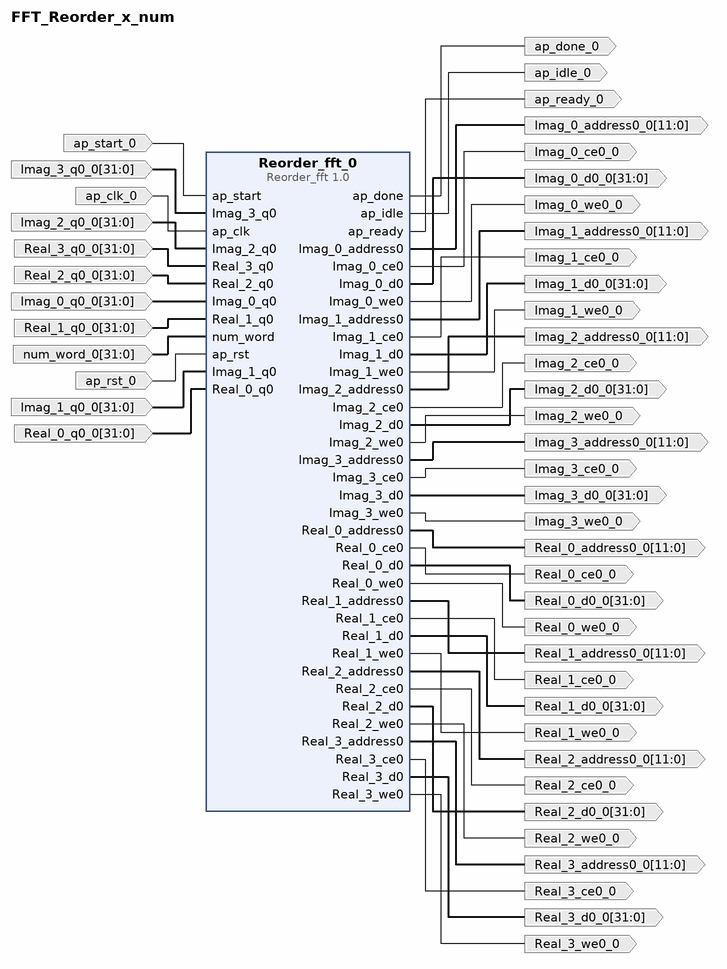
[diagram p0: block diagram of the top level]
# Vivado block design FFT_Reorder_x_num, xc7z045ffg900-2, Vivado 2018.3
create_bd_design FFT_Reorder_x_num

create_bd_port -dir I ap_start_0
create_bd_port -dir I -from 31 -to 0 -type data Imag_3_q0_0
set_property -dict [list \
  CONFIG.LAYERED_METADATA {xilinx.com:interface:datatypes:1.0 {DATA {datatype {name {attribs {resolve_type immediate dependency {} format string minimum {} maximum {}} value {}} bitwidth {attribs {resolve_type immediate dependency {} format long minimum {} maximum {}} value 32} bitoffset {attribs {resolve_type immediate dependency {} format long minimum {} maximum {}} value 0} real {float {sigwidth {attribs {resolve_type immediate dependency {} format long minimum {} maximum {}} value 24}}}}}}} \
] [get_bd_ports Imag_3_q0_0]
create_bd_port -dir O Imag_3_we0_0
create_bd_port -dir O -from 11 -to 0 -type data Real_1_address0_0
create_bd_port -dir O -from 31 -to 0 -type data Real_3_d0_0
create_bd_port -dir I -type clk ap_clk_0
create_bd_port -dir I -from 31 -to 0 -type data Imag_2_q0_0
set_property -dict [list \
  CONFIG.LAYERED_METADATA {xilinx.com:interface:datatypes:1.0 {DATA {datatype {name {attribs {resolve_type immediate dependency {} format string minimum {} maximum {}} value {}} bitwidth {attribs {resolve_type immediate dependency {} format long minimum {} maximum {}} value 32} bitoffset {attribs {resolve_type immediate dependency {} format long minimum {} maximum {}} value 0} real {float {sigwidth {attribs {resolve_type immediate dependency {} format long minimum {} maximum {}} value 24}}}}}}} \
] [get_bd_ports Imag_2_q0_0]
create_bd_port -dir O -from 11 -to 0 -type data Real_0_address0_0
create_bd_port -dir O Real_0_we0_0
create_bd_port -dir I -from 31 -to 0 -type data Real_3_q0_0
set_property -dict [list \
  CONFIG.LAYERED_METADATA {xilinx.com:interface:datatypes:1.0 {DATA {datatype {name {attribs {resolve_type immediate dependency {} format string minimum {} maximum {}} value {}} bitwidth {attribs {resolve_type immediate dependency {} format long minimum {} maximum {}} value 32} bitoffset {attribs {resolve_type immediate dependency {} format long minimum {} maximum {}} value 0} real {float {sigwidth {attribs {resolve_type immediate dependency {} format long minimum {} maximum {}} value 24}}}}}}} \
] [get_bd_ports Real_3_q0_0]
create_bd_port -dir O -from 11 -to 0 -type data Imag_3_address0_0
create_bd_port -dir O -from 31 -to 0 -type data Real_0_d0_0
create_bd_port -dir O Real_1_ce0_0
create_bd_port -dir I -from 31 -to 0 -type data Real_2_q0_0
set_property -dict [list \
  CONFIG.LAYERED_METADATA {xilinx.com:interface:datatypes:1.0 {DATA {datatype {name {attribs {resolve_type immediate dependency {} format string minimum {} maximum {}} value {}} bitwidth {attribs {resolve_type immediate dependency {} format long minimum {} maximum {}} value 32} bitoffset {attribs {resolve_type immediate dependency {} format long minimum {} maximum {}} value 0} real {float {sigwidth {attribs {resolve_type immediate dependency {} format long minimum {} maximum {}} value 24}}}}}}} \
] [get_bd_ports Real_2_q0_0]
create_bd_port -dir O -from 11 -to 0 -type data Real_2_address0_0
create_bd_port -dir O -from 11 -to 0 -type data Real_3_address0_0
create_bd_port -dir I -from 31 -to 0 -type data Imag_0_q0_0
set_property -dict [list \
  CONFIG.LAYERED_METADATA {xilinx.com:interface:datatypes:1.0 {DATA {datatype {name {attribs {resolve_type immediate dependency {} format string minimum {} maximum {}} value {}} bitwidth {attribs {resolve_type immediate dependency {} format long minimum {} maximum {}} value 32} bitoffset {attribs {resolve_type immediate dependency {} format long minimum {} maximum {}} value 0} real {float {sigwidth {attribs {resolve_type immediate dependency {} format long minimum {} maximum {}} value 24}}}}}}} \
] [get_bd_ports Imag_0_q0_0]
create_bd_port -dir O Real_0_ce0_0
create_bd_port -dir O -from 31 -to 0 -type data Real_2_d0_0
create_bd_port -dir O -from 11 -to 0 -type data Imag_1_address0_0
create_bd_port -dir O -from 31 -to 0 -type data Real_1_d0_0
create_bd_port -dir O Real_2_we0_0
create_bd_port -dir O -from 11 -to 0 -type data Imag_0_address0_0
create_bd_port -dir I -from 31 -to 0 -type data Real_1_q0_0
set_property -dict [list \
  CONFIG.LAYERED_METADATA {xilinx.com:interface:datatypes:1.0 {DATA {datatype {name {attribs {resolve_type immediate dependency {} format string minimum {} maximum {}} value {}} bitwidth {attribs {resolve_type immediate dependency {} format long minimum {} maximum {}} value 32} bitoffset {attribs {resolve_type immediate dependency {} format long minimum {} maximum {}} value 0} real {float {sigwidth {attribs {resolve_type immediate dependency {} format long minimum {} maximum {}} value 24}}}}}}} \
] [get_bd_ports Real_1_q0_0]
create_bd_port -dir O Real_3_ce0_0
create_bd_port -dir O -from 31 -to 0 -type data Imag_0_d0_0
create_bd_port -dir O Imag_2_we0_0
create_bd_port -dir O Real_1_we0_0
create_bd_port -dir O -from 11 -to 0 -type data Imag_2_address0_0
create_bd_port -dir O Imag_3_ce0_0
create_bd_port -dir O Real_2_ce0_0
create_bd_port -dir O Imag_0_we0_0
create_bd_port -dir O Imag_1_we0_0
create_bd_port -dir O -from 31 -to 0 -type data Imag_2_d0_0
create_bd_port -dir I -from 31 -to 0 -type data num_word_0
set_property -dict [list \
  CONFIG.LAYERED_METADATA {xilinx.com:interface:datatypes:1.0 {DATA {datatype {name {attribs {resolve_type immediate dependency {} format string minimum {} maximum {}} value {}} bitwidth {attribs {resolve_type immediate dependency {} format long minimum {} maximum {}} value 32} bitoffset {attribs {resolve_type immediate dependency {} format long minimum {} maximum {}} value 0} integer {signed {attribs {resolve_type immediate dependency {} format bool minimum {} maximum {}} value true}}}}}} \
] [get_bd_ports num_word_0]
create_bd_port -dir O Imag_1_ce0_0
create_bd_port -dir O -from 31 -to 0 -type data Imag_1_d0_0
create_bd_port -dir O Imag_2_ce0_0
create_bd_port -dir O ap_done_0
create_bd_port -dir O ap_idle_0
create_bd_port -dir I -type rst ap_rst_0
set_property -dict {CONFIG.POLARITY ACTIVE_HIGH} [get_bd_ports ap_rst_0]
create_bd_port -dir I -from 31 -to 0 -type data Imag_1_q0_0
set_property -dict [list \
  CONFIG.LAYERED_METADATA {xilinx.com:interface:datatypes:1.0 {DATA {datatype {name {attribs {resolve_type immediate dependency {} format string minimum {} maximum {}} value {}} bitwidth {attribs {resolve_type immediate dependency {} format long minimum {} maximum {}} value 32} bitoffset {attribs {resolve_type immediate dependency {} format long minimum {} maximum {}} value 0} real {float {sigwidth {attribs {resolve_type immediate dependency {} format long minimum {} maximum {}} value 24}}}}}}} \
] [get_bd_ports Imag_1_q0_0]
create_bd_port -dir O Real_3_we0_0
create_bd_port -dir O Imag_0_ce0_0
create_bd_port -dir O -from 31 -to 0 -type data Imag_3_d0_0
create_bd_port -dir I -from 31 -to 0 -type data Real_0_q0_0
set_property -dict [list \
  CONFIG.LAYERED_METADATA {xilinx.com:interface:datatypes:1.0 {DATA {datatype {name {attribs {resolve_type immediate dependency {} format string minimum {} maximum {}} value {}} bitwidth {attribs {resolve_type immediate dependency {} format long minimum {} maximum {}} value 32} bitoffset {attribs {resolve_type immediate dependency {} format long minimum {} maximum {}} value 0} real {float {sigwidth {attribs {resolve_type immediate dependency {} format long minimum {} maximum {}} value 24}}}}}}} \
] [get_bd_ports Real_0_q0_0]
create_bd_port -dir O ap_ready_0

create_bd_cell -type ip -vlnv xilinx.com:hls:Reorder_fft:1.0 Reorder_fft_0

# ---- connections ----

connect_bd_net -net ap_start_0_1 [get_bd_ports ap_start_0] [get_bd_pins Reorder_fft_0/ap_start]
connect_bd_net -net Imag_3_q0_0_1 [get_bd_ports Imag_3_q0_0] [get_bd_pins Reorder_fft_0/Imag_3_q0]
connect_bd_net [get_bd_pins Reorder_fft_0/Imag_3_we0] [get_bd_ports Imag_3_we0_0]
connect_bd_net [get_bd_pins Reorder_fft_0/Real_1_address0] [get_bd_ports Real_1_address0_0]
connect_bd_net [get_bd_pins Reorder_fft_0/Real_3_d0] [get_bd_ports Real_3_d0_0]
connect_bd_net -net ap_clk_0_1 [get_bd_ports ap_clk_0] [get_bd_pins Reorder_fft_0/ap_clk]
connect_bd_net -net Imag_2_q0_0_1 [get_bd_ports Imag_2_q0_0] [get_bd_pins Reorder_fft_0/Imag_2_q0]
connect_bd_net [get_bd_pins Reorder_fft_0/Real_0_address0] [get_bd_ports Real_0_address0_0]
connect_bd_net [get_bd_pins Reorder_fft_0/Real_0_we0] [get_bd_ports Real_0_we0_0]
connect_bd_net -net Real_3_q0_0_1 [get_bd_ports Real_3_q0_0] [get_bd_pins Reorder_fft_0/Real_3_q0]
connect_bd_net [get_bd_pins Reorder_fft_0/Imag_3_address0] [get_bd_ports Imag_3_address0_0]
connect_bd_net [get_bd_pins Reorder_fft_0/Real_0_d0] [get_bd_ports Real_0_d0_0]
connect_bd_net [get_bd_pins Reorder_fft_0/Real_1_ce0] [get_bd_ports Real_1_ce0_0]
connect_bd_net -net Real_2_q0_0_1 [get_bd_ports Real_2_q0_0] [get_bd_pins Reorder_fft_0/Real_2_q0]
connect_bd_net [get_bd_pins Reorder_fft_0/Real_2_address0] [get_bd_ports Real_2_address0_0]
connect_bd_net [get_bd_pins Reorder_fft_0/Real_3_address0] [get_bd_ports Real_3_address0_0]
connect_bd_net -net Imag_0_q0_0_1 [get_bd_ports Imag_0_q0_0] [get_bd_pins Reorder_fft_0/Imag_0_q0]
connect_bd_net [get_bd_pins Reorder_fft_0/Real_0_ce0] [get_bd_ports Real_0_ce0_0]
connect_bd_net [get_bd_pins Reorder_fft_0/Real_2_d0] [get_bd_ports Real_2_d0_0]
connect_bd_net [get_bd_pins Reorder_fft_0/Imag_1_address0] [get_bd_ports Imag_1_address0_0]
connect_bd_net [get_bd_pins Reorder_fft_0/Real_1_d0] [get_bd_ports Real_1_d0_0]
connect_bd_net [get_bd_pins Reorder_fft_0/Real_2_we0] [get_bd_ports Real_2_we0_0]
connect_bd_net [get_bd_pins Reorder_fft_0/Imag_0_address0] [get_bd_ports Imag_0_address0_0]
connect_bd_net -net Real_1_q0_0_1 [get_bd_ports Real_1_q0_0] [get_bd_pins Reorder_fft_0/Real_1_q0]
connect_bd_net [get_bd_pins Reorder_fft_0/Real_3_ce0] [get_bd_ports Real_3_ce0_0]
connect_bd_net [get_bd_pins Reorder_fft_0/Imag_0_d0] [get_bd_ports Imag_0_d0_0]
connect_bd_net [get_bd_pins Reorder_fft_0/Imag_2_we0] [get_bd_ports Imag_2_we0_0]
connect_bd_net [get_bd_pins Reorder_fft_0/Real_1_we0] [get_bd_ports Real_1_we0_0]
connect_bd_net [get_bd_pins Reorder_fft_0/Imag_2_address0] [get_bd_ports Imag_2_address0_0]
connect_bd_net [get_bd_pins Reorder_fft_0/Imag_3_ce0] [get_bd_ports Imag_3_ce0_0]
connect_bd_net [get_bd_pins Reorder_fft_0/Real_2_ce0] [get_bd_ports Real_2_ce0_0]
connect_bd_net [get_bd_pins Reorder_fft_0/Imag_0_we0] [get_bd_ports Imag_0_we0_0]
connect_bd_net [get_bd_pins Reorder_fft_0/Imag_1_we0] [get_bd_ports Imag_1_we0_0]
connect_bd_net [get_bd_pins Reorder_fft_0/Imag_2_d0] [get_bd_ports Imag_2_d0_0]
connect_bd_net -net num_word_0_1 [get_bd_ports num_word_0] [get_bd_pins Reorder_fft_0/num_word]
connect_bd_net [get_bd_pins Reorder_fft_0/Imag_1_ce0] [get_bd_ports Imag_1_ce0_0]
connect_bd_net [get_bd_pins Reorder_fft_0/Imag_1_d0] [get_bd_ports Imag_1_d0_0]
connect_bd_net [get_bd_pins Reorder_fft_0/Imag_2_ce0] [get_bd_ports Imag_2_ce0_0]
connect_bd_net [get_bd_pins Reorder_fft_0/ap_done] [get_bd_ports ap_done_0]
connect_bd_net [get_bd_pins Reorder_fft_0/ap_idle] [get_bd_ports ap_idle_0]
connect_bd_net -net ap_rst_0_1 [get_bd_ports ap_rst_0] [get_bd_pins Reorder_fft_0/ap_rst]
connect_bd_net -net Imag_1_q0_0_1 [get_bd_ports Imag_1_q0_0] [get_bd_pins Reorder_fft_0/Imag_1_q0]
connect_bd_net [get_bd_pins Reorder_fft_0/Real_3_we0] [get_bd_ports Real_3_we0_0]
connect_bd_net [get_bd_pins Reorder_fft_0/Imag_0_ce0] [get_bd_ports Imag_0_ce0_0]
connect_bd_net [get_bd_pins Reorder_fft_0/Imag_3_d0] [get_bd_ports Imag_3_d0_0]
connect_bd_net -net Real_0_q0_0_1 [get_bd_ports Real_0_q0_0] [get_bd_pins Reorder_fft_0/Real_0_q0]
connect_bd_net [get_bd_pins Reorder_fft_0/ap_ready] [get_bd_ports ap_ready_0]

validate_bd_design
save_bd_design
